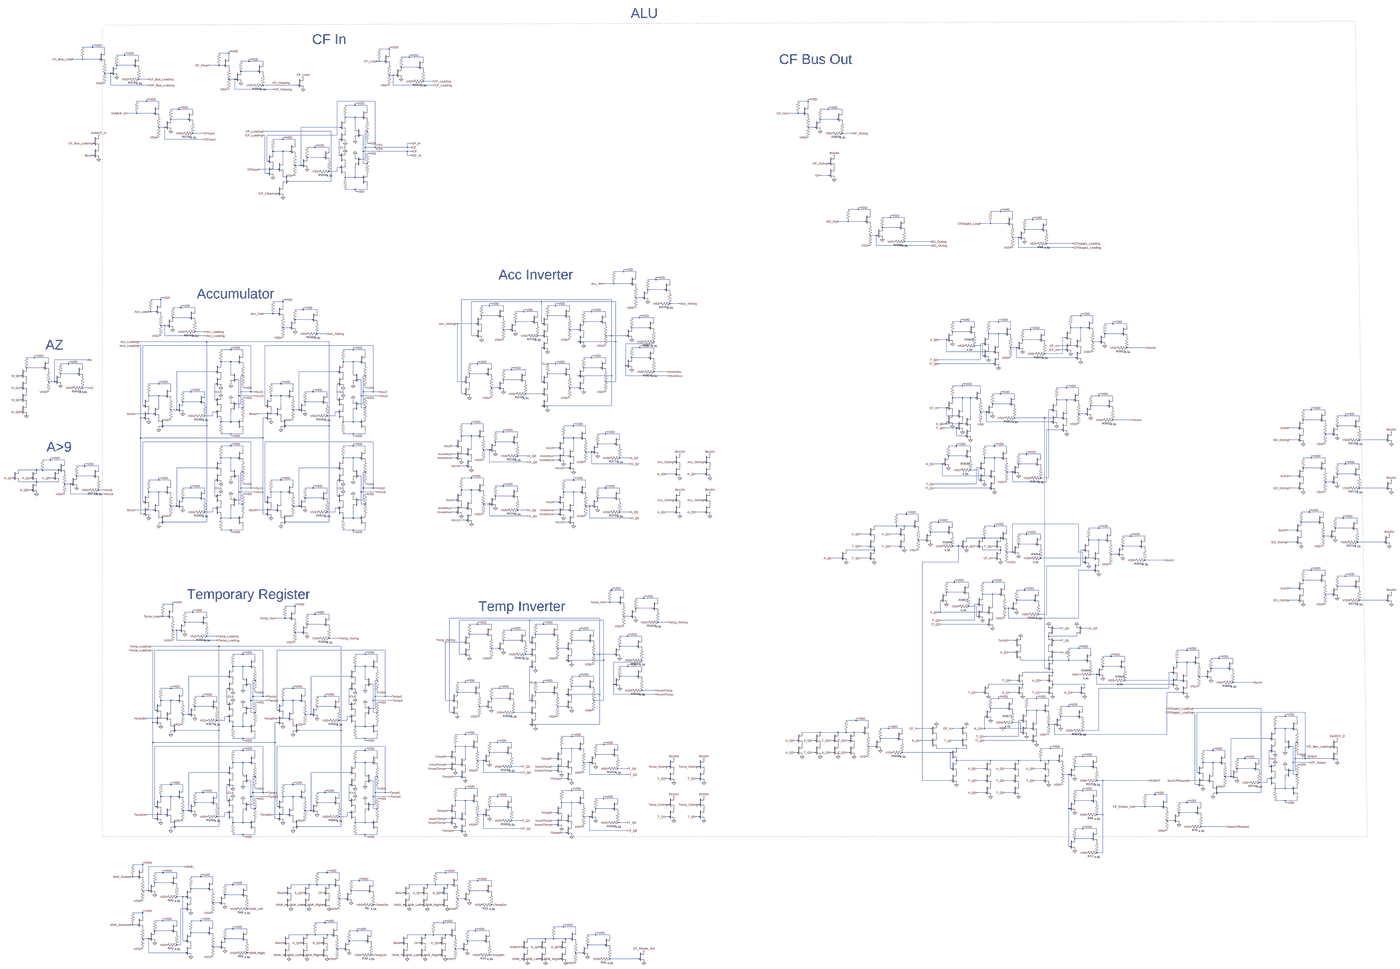
[diagram p0: schematic alu.asc, whole sheet]
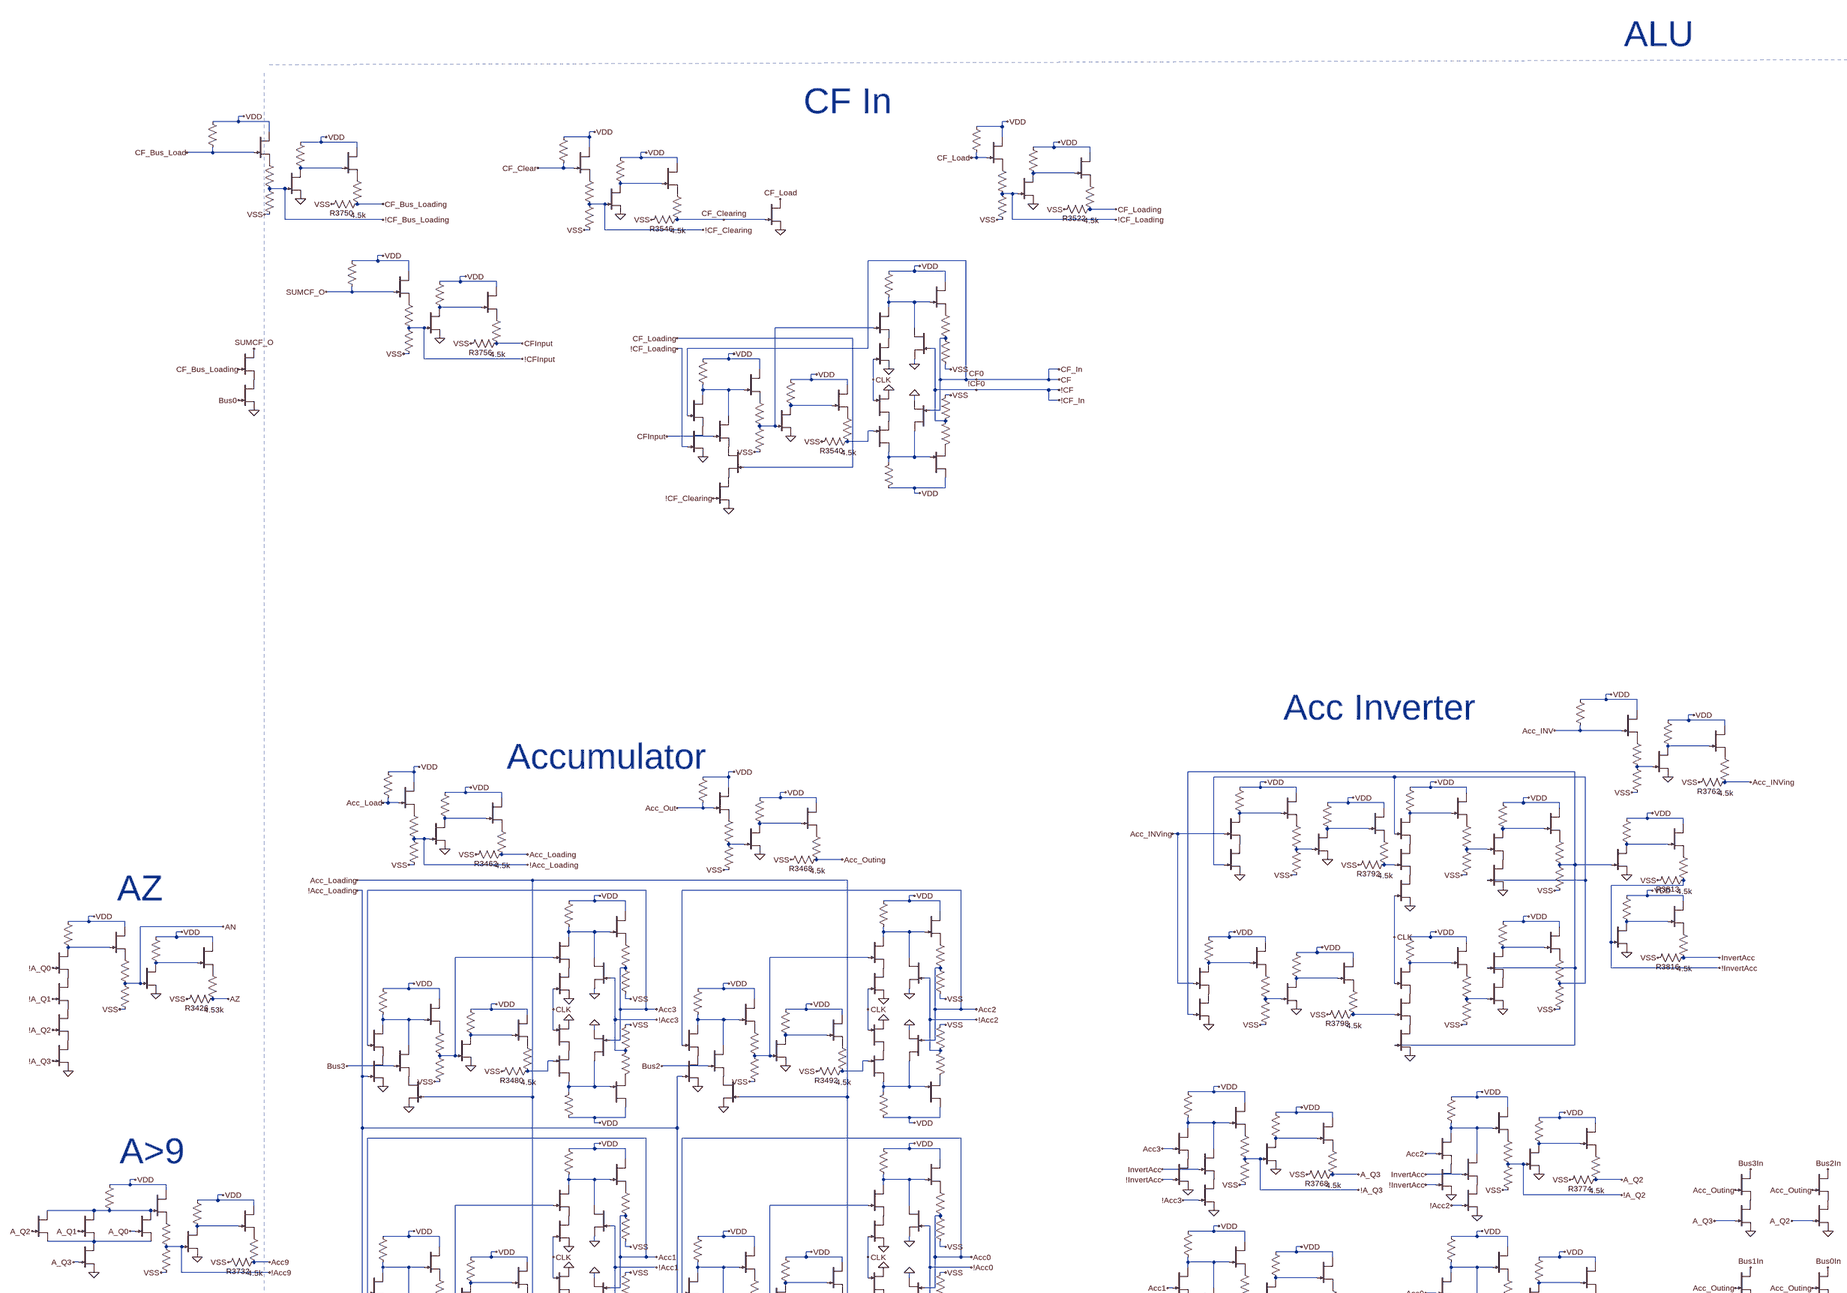
[diagram p1: schematic alu.asc, part, row 1 of 2, column 1 of 2]
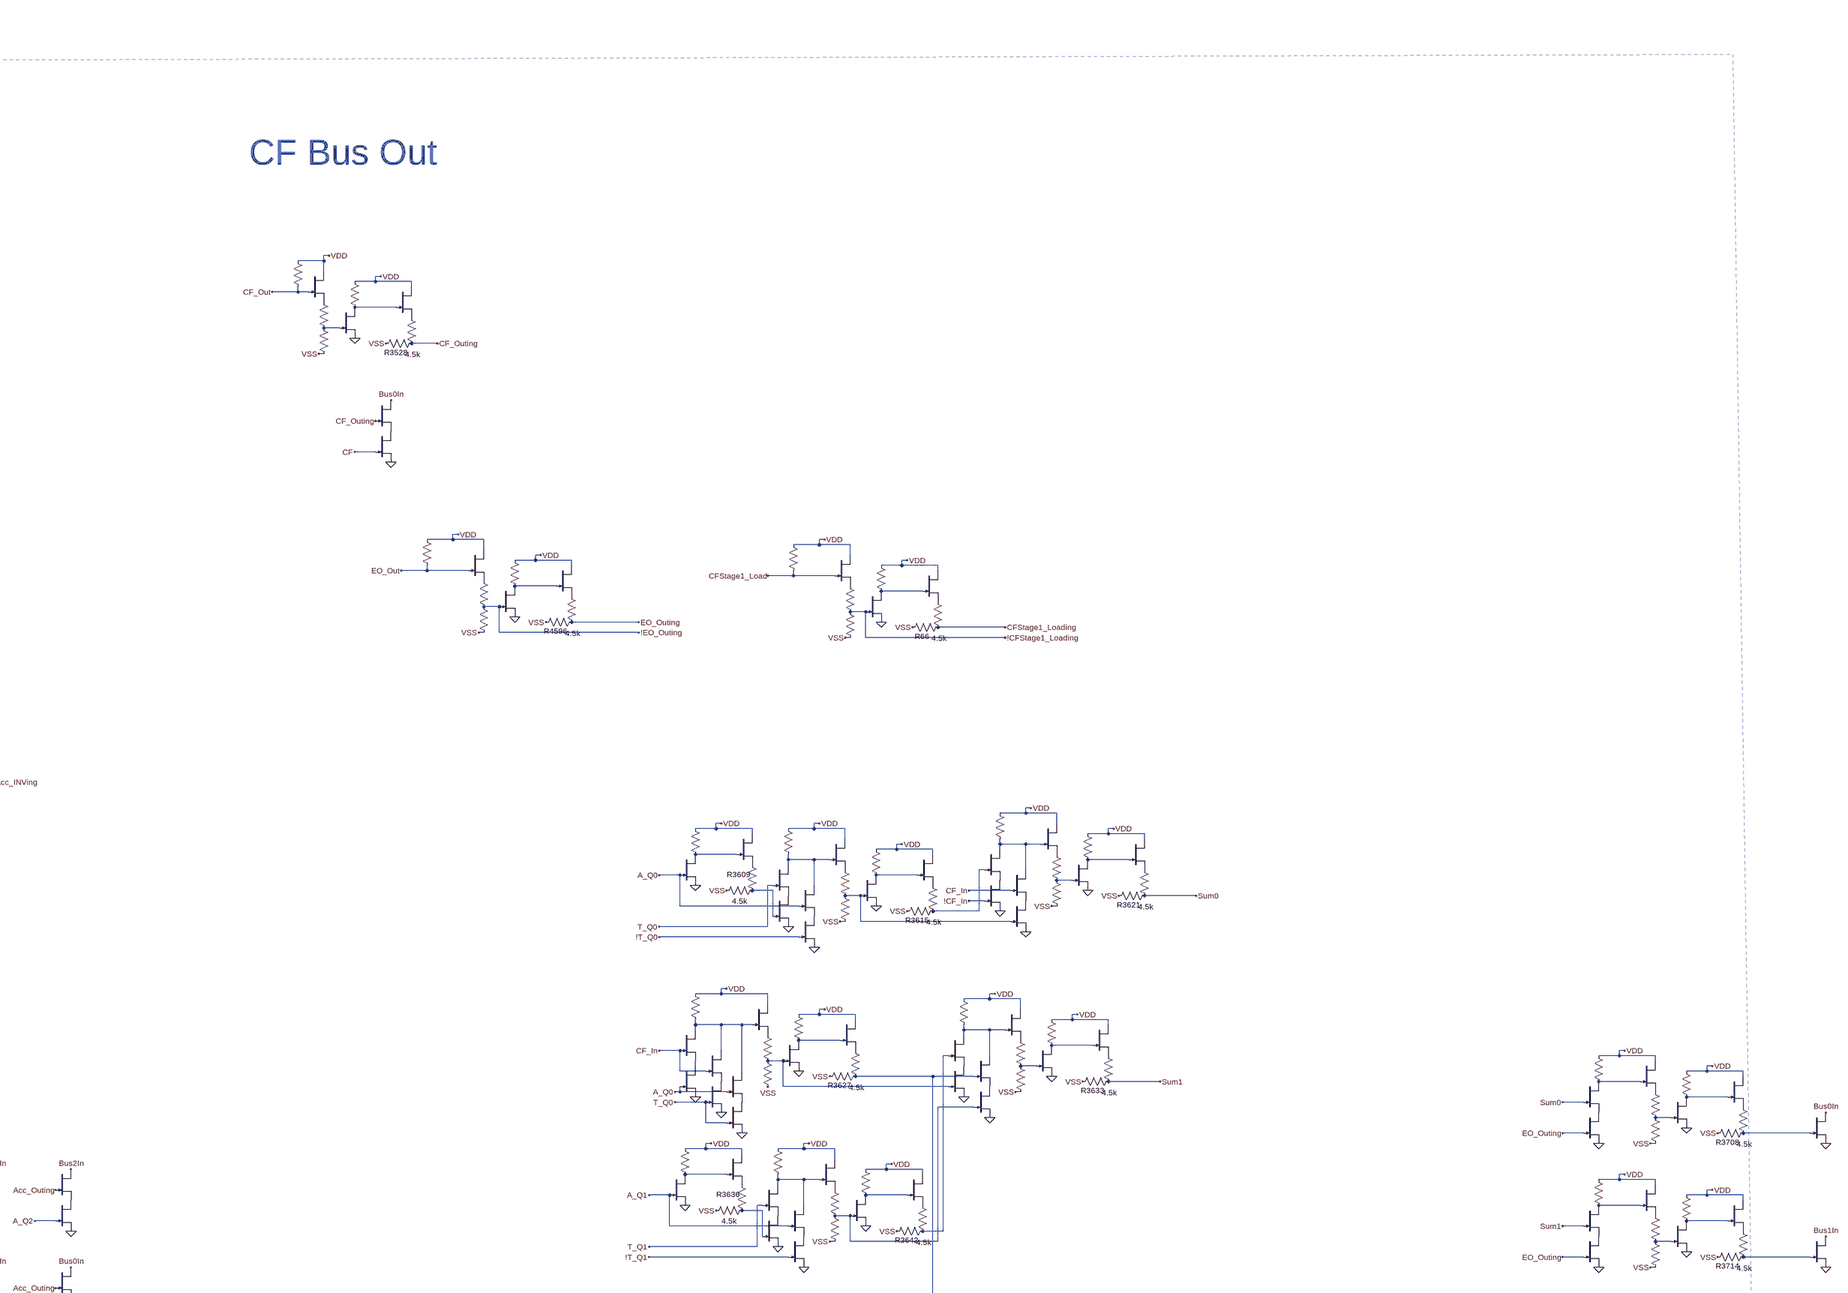
[diagram p2: schematic alu.asc, part, row 1 of 2, column 2 of 2]
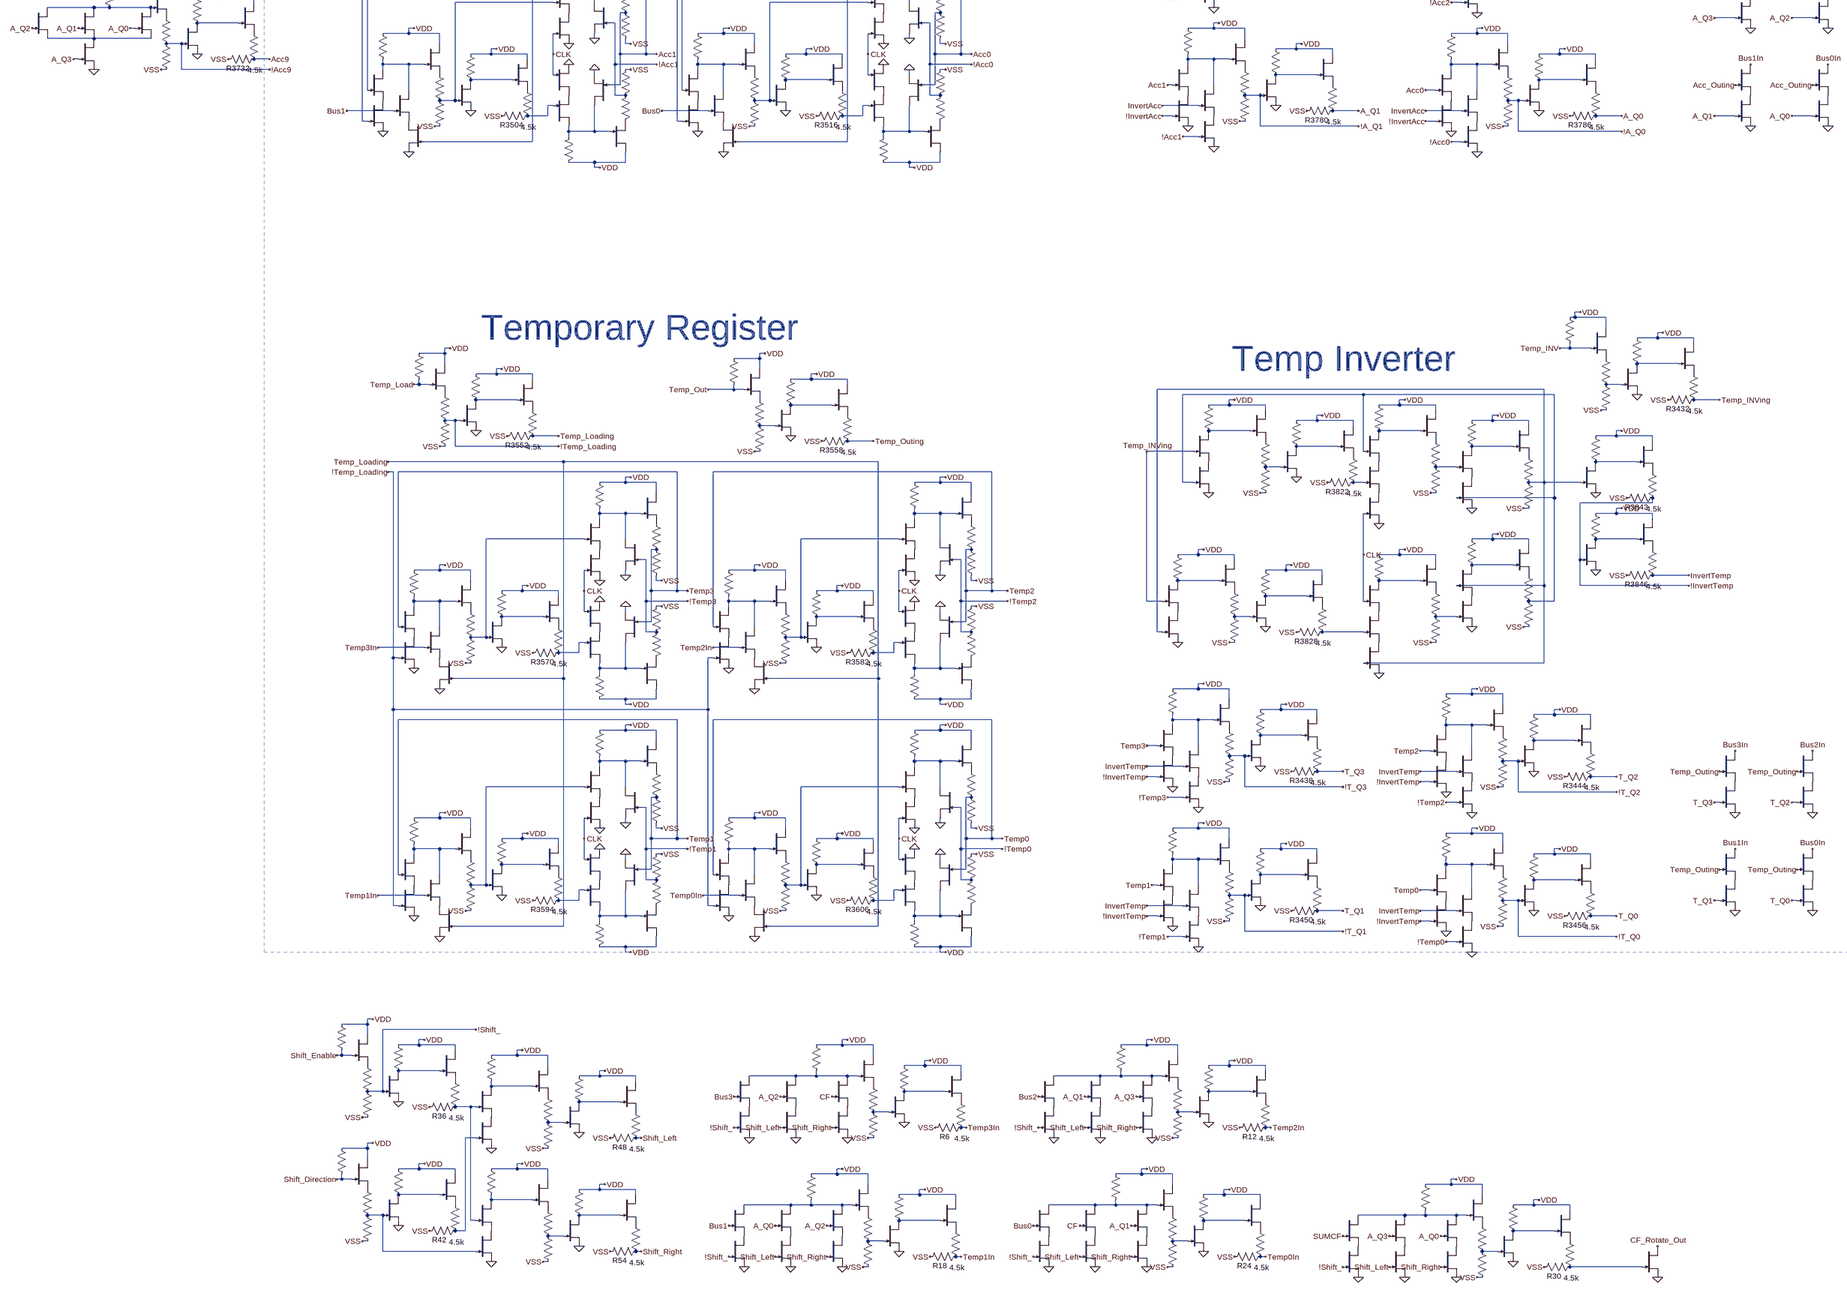
[diagram p3: schematic alu.asc, part, row 2 of 2, column 1 of 2]
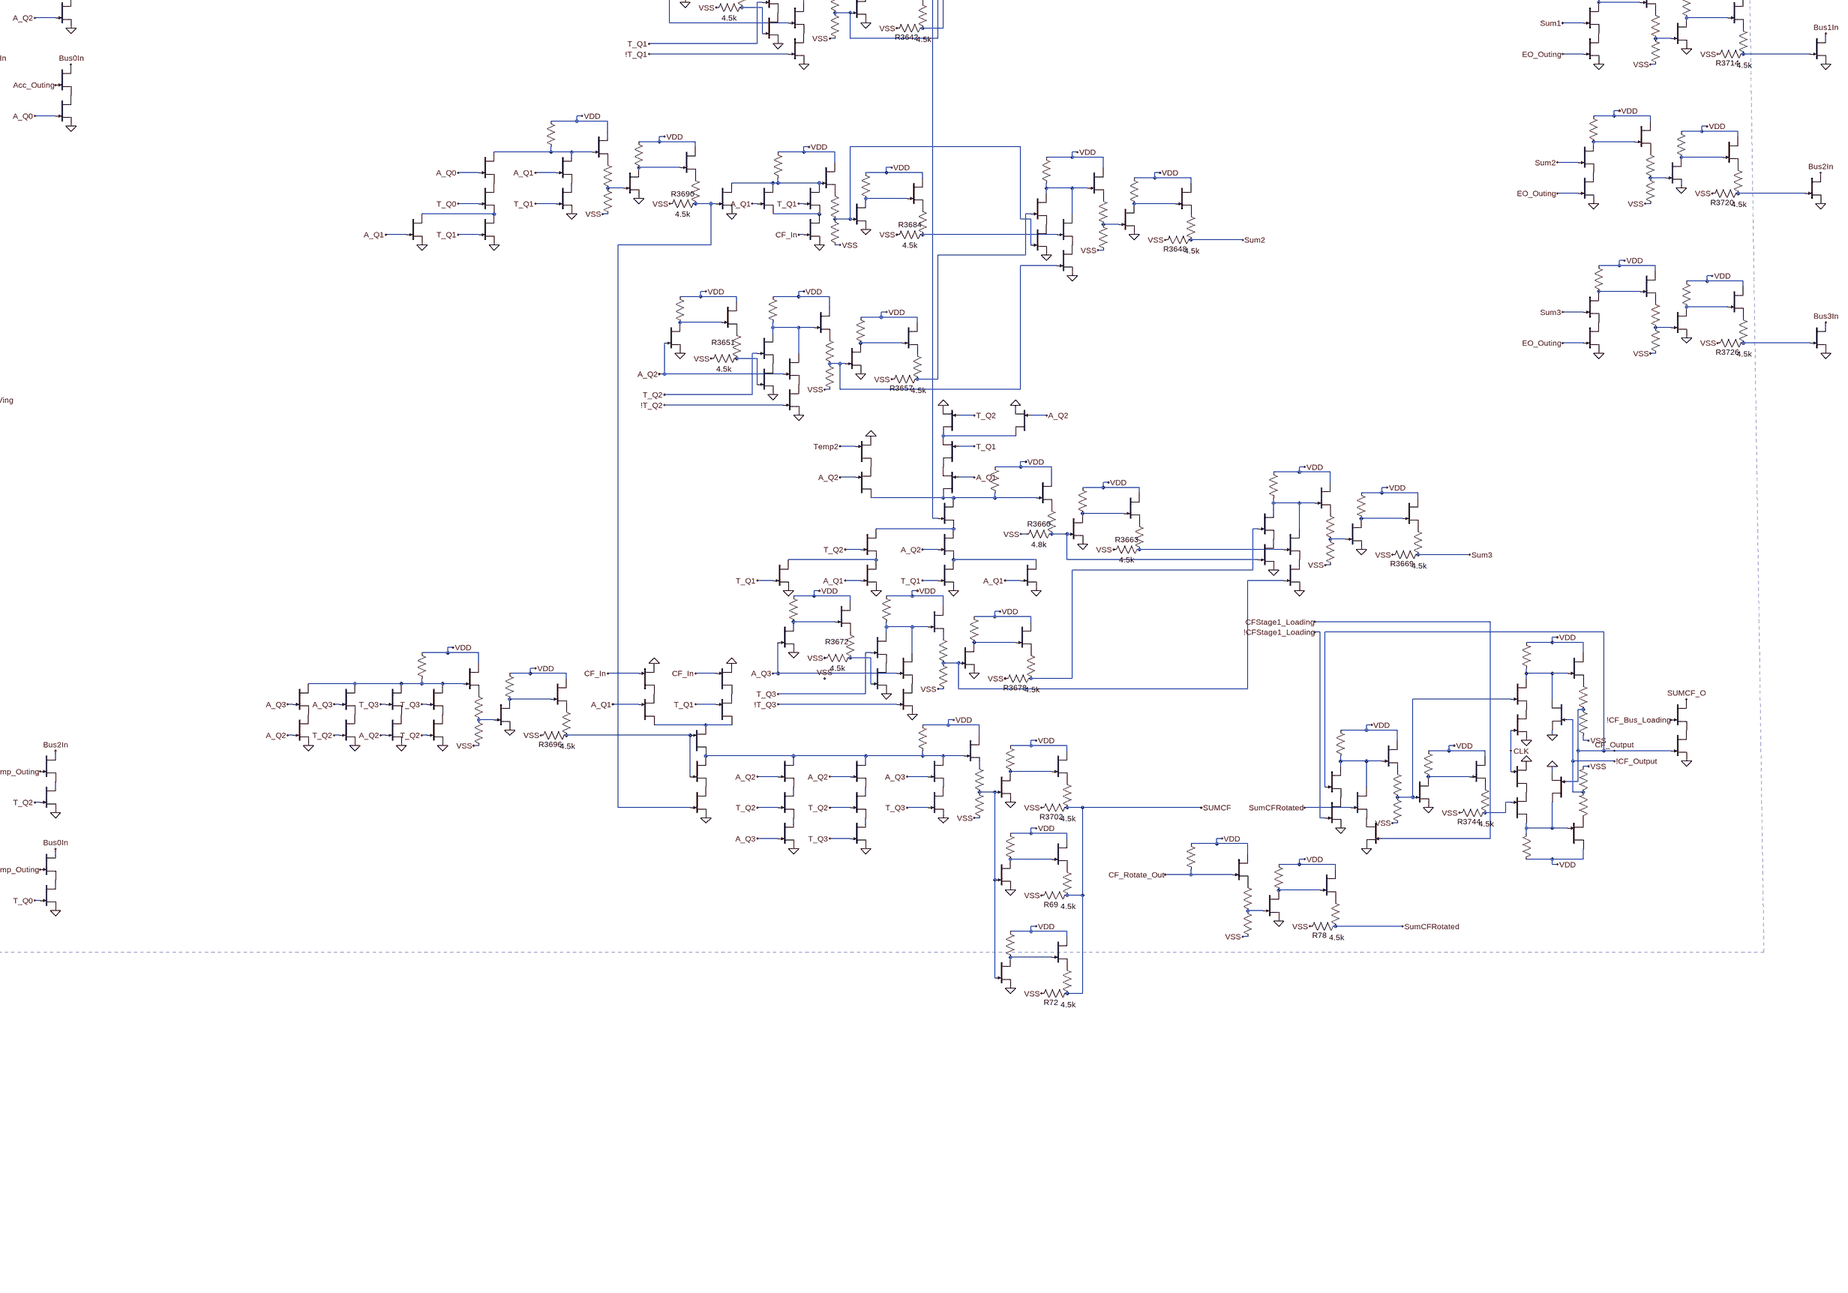
[diagram p4: schematic alu.asc, part, row 2 of 2, column 2 of 2]
* alu.asc
J_A2103 N042 !A_Q0 P001 DR
R3421 VDD N042 100k
J_F874 VDD N042 P002 DR
R3422 P002 AN 1k
R3423 AN VSS 4.8k
J_B993 P001 !A_Q1 P003 DR
J_A2104 N046 AN 0 DR
R3424 VDD N046 50k
J_F875 VDD N046 P004 DR
R3425 P004 AZ 1k
R3426 AZ VSS 4.53k
J_C1 P003 !A_Q2 P005 DR
J_D1 P005 !A_Q3 0 DR
J_A2105 P006 T_Q3 0 DR
J_A2106 Bus3In Temp_Outing P006 DR
J_A2107 P007 T_Q2 0 DR
J_A2108 Bus2In Temp_Outing P007 DR
J_A2109 P008 T_Q1 0 DR
J_A2110 Bus1In Temp_Outing P008 DR
J_A2111 P009 T_Q0 0 DR
J_A2112 Bus0In Temp_Outing P009 DR
R3427 VDD Temp_INV 100k
J_F876 VDD Temp_INV P010 DR
R3428 P010 N134 1k
R3429 N134 VSS 4.8k
J_A2113 N133 N134 0 DR
R3430 VDD N133 50k
J_A2114 VDD N133 P011 DR
R3431 P011 Temp_INVing 1k
R3432 Temp_INVing VSS 4.5k
J_A2115 N189 Temp3 P012 DR
R3433 VDD N189 100k
J_F877 VDD N189 P013 DR
R3434 P013 !T_Q3 1k
R3435 !T_Q3 VSS 4.8k
J_B994 N189 InvertTemp P014 DR
J_A2116 N193 !T_Q3 0 DR
R3436 VDD N193 50k
J_A2117 VDD N193 P015 DR
R3437 P015 T_Q3 1k
R3438 T_Q3 VSS 4.5k
J_A2118 P012 !InvertTemp 0 DR
J_B995 P014 !Temp3 0 DR
J_A2119 N191 Temp2 P016 DR
R3439 VDD N191 100k
J_F878 VDD N191 P017 DR
R3440 P017 !T_Q2 1k
R3441 !T_Q2 VSS 4.8k
J_B996 N191 InvertTemp P018 DR
J_A2120 N195 !T_Q2 0 DR
R3442 VDD N195 50k
J_A2121 VDD N195 P019 DR
R3443 P019 T_Q2 1k
R3444 T_Q2 VSS 4.5k
J_A2122 P016 !InvertTemp 0 DR
J_B997 P018 !Temp2 0 DR
J_A2123 N209 Temp1 P020 DR
R3445 VDD N209 100k
J_F879 VDD N209 P021 DR
R3446 P021 !T_Q1 1k
R3447 !T_Q1 VSS 4.8k
J_B998 N209 InvertTemp P022 DR
J_A2124 N214 !T_Q1 0 DR
R3448 VDD N214 50k
J_A2125 VDD N214 P023 DR
R3449 P023 T_Q1 1k
R3450 T_Q1 VSS 4.5k
J_A2126 P020 !InvertTemp 0 DR
J_B999 P022 !Temp1 0 DR
J_A2127 N213 Temp0 P024 DR
R3451 VDD N213 100k
J_F880 VDD N213 P025 DR
R3452 P025 !T_Q0 1k
R3453 !T_Q0 VSS 4.8k
J_B1000 N213 InvertTemp P026 DR
J_A2128 N215 !T_Q0 0 DR
R3454 VDD N215 50k
J_A2129 VDD N215 P027 DR
R3455 P027 T_Q0 1k
R3456 T_Q0 VSS 4.5k
J_A2130 P024 !InvertTemp 0 DR
J_B1001 P026 !Temp0 0 DR
R3457 VDD Acc_Load 100k
J_F881 VDD Acc_Load P028 DR
R3458 P028 !Acc_Loading 1k
R3459 !Acc_Loading VSS 4.8k
J_A2131 N021 !Acc_Loading 0 DR
R3460 VDD N021 50k
J_A2132 VDD N021 P029 DR
R3461 P029 Acc_Loading 1k
R3462 Acc_Loading VSS 4.5k
R3463 VDD Acc_Out 100k
J_F882 VDD Acc_Out P030 DR
R3464 P030 N025 1k
R3465 N025 VSS 4.8k
J_A2133 N022 N025 0 DR
R3466 VDD N022 50k
J_A2134 VDD N022 P031 DR
R3467 P031 Acc_Outing 1k
R3468 Acc_Outing VSS 4.5k
J_A2135 N040 N044 P032 DR
R3469 VDD N040 100k
J_F883 VDD N040 P033 DR
R3470 P033 Acc3 1k
R3471 Acc3 VSS 4.8k
J_B1002 N040 !Acc3 0 DR
J_A2136 N069 N062 P034 DR
R3472 VDD N069 100k
J_F884 VDD N069 P035 DR
R3473 P035 !Acc3 1k
R3474 !Acc3 VSS 4.8k
J_B1003 N069 Acc3 0 DR
J_A2137 P032 CLK 0 DR
J_A2138 P034 CLK 0 DR
J_A2139 N053 Acc3 P036 DR
R3475 VDD N053 100k
J_F885 VDD N053 P037 DR
R3476 P037 N044 1k
R3477 N044 VSS 4.8k
J_B1004 N053 Bus3 P038 DR
J_A2140 N057 N044 0 DR
R3478 VDD N057 50k
J_A2141 VDD N057 P039 DR
R3479 P039 N062 1k
R3480 N062 VSS 4.5k
J_A2142 P036 !Acc_Loading 0 DR
J_B1005 P038 Acc_Loading 0 DR
J_A2143 N041 N045 P040 DR
R3481 VDD N041 100k
J_F886 VDD N041 P041 DR
R3482 P041 Acc2 1k
R3483 Acc2 VSS 4.8k
J_B1006 N041 !Acc2 0 DR
J_A2144 N070 N063 P042 DR
R3484 VDD N070 100k
J_F887 VDD N070 P043 DR
R3485 P043 !Acc2 1k
R3486 !Acc2 VSS 4.8k
J_B1007 N070 Acc2 0 DR
J_A2145 P040 CLK 0 DR
J_A2146 P042 CLK 0 DR
J_A2147 N054 Acc2 P044 DR
R3487 VDD N054 100k
J_F888 VDD N054 P045 DR
R3488 P045 N045 1k
R3489 N045 VSS 4.8k
J_B1008 N054 Bus2 P046 DR
J_A2148 N058 N045 0 DR
R3490 VDD N058 50k
J_A2149 VDD N058 P047 DR
R3491 P047 N063 1k
R3492 N063 VSS 4.5k
J_A2150 P044 !Acc_Loading 0 DR
J_B1009 P046 Acc_Loading 0 DR
J_A2151 N080 N084 P048 DR
R3493 VDD N080 100k
J_F889 VDD N080 P049 DR
R3494 P049 Acc1 1k
R3495 Acc1 VSS 4.8k
J_B1010 N080 !Acc1 0 DR
J_A2152 N104 N102 P050 DR
R3496 VDD N104 100k
J_F890 VDD N104 P051 DR
R3497 P051 !Acc1 1k
R3498 !Acc1 VSS 4.8k
J_B1011 N104 Acc1 0 DR
J_A2153 P048 CLK 0 DR
J_A2154 P050 CLK 0 DR
J_A2155 N095 Acc1 P052 DR
R3499 VDD N095 100k
J_F891 VDD N095 P053 DR
R3500 P053 N084 1k
R3501 N084 VSS 4.8k
J_B1012 N095 Bus1 P054 DR
J_A2156 N099 N084 0 DR
R3502 VDD N099 50k
J_A2157 VDD N099 P055 DR
R3503 P055 N102 1k
R3504 N102 VSS 4.5k
J_A2158 P052 !Acc_Loading 0 DR
J_B1013 P054 Acc_Loading 0 DR
J_A2159 N081 N085 P056 DR
R3505 VDD N081 100k
J_F892 VDD N081 P057 DR
R3506 P057 Acc0 1k
R3507 Acc0 VSS 4.8k
J_B1014 N081 !Acc0 0 DR
J_A2160 N105 N103 P058 DR
R3508 VDD N105 100k
J_F893 VDD N105 P059 DR
R3509 P059 !Acc0 1k
R3510 !Acc0 VSS 4.8k
J_B1015 N105 Acc0 0 DR
J_A2161 P056 CLK 0 DR
J_A2162 P058 CLK 0 DR
J_A2163 N096 Acc0 P060 DR
R3511 VDD N096 100k
J_F894 VDD N096 P061 DR
R3512 P061 N085 1k
R3513 N085 VSS 4.8k
J_B1016 N096 Bus0 P062 DR
J_A2164 N100 N085 0 DR
R3514 VDD N100 50k
J_A2165 VDD N100 P063 DR
R3515 P063 N103 1k
R3516 N103 VSS 4.5k
J_A2166 P060 !Acc_Loading 0 DR
J_B1017 P062 Acc_Loading 0 DR
R3517 VDD CF_Load 100k
J_F895 VDD CF_Load P064 DR
R3518 P064 !CF_Loading 1k
R3519 !CF_Loading VSS 4.8k
J_A2167 N002 !CF_Loading 0 DR
R3520 VDD N002 50k
J_A2168 VDD N002 P065 DR
R3521 P065 CF_Loading 1k
R3522 CF_Loading VSS 4.5k
R3523 VDD CF_Out 100k
J_F896 VDD CF_Out P066 DR
R3524 P066 N008 1k
R3525 N008 VSS 4.8k
J_A2169 N006 N008 0 DR
R3526 VDD N006 50k
J_A2170 VDD N006 P067 DR
R3527 P067 CF_Outing 1k
R3528 CF_Outing VSS 4.5k
J_A2171 N004 N007 P068 DR
R3529 VDD N004 100k
J_F897 VDD N004 P069 DR
R3530 P069 CF0 1k
R3531 CF0 VSS 4.8k
J_B1018 N004 !CF 0 DR
J_A2172 N012 N011 P070 DR
R3532 VDD N012 100k
J_F898 VDD N012 P071 DR
R3533 P071 !CF 1k
R3534 !CF VSS 4.8k
J_B1019 N012 CF0 0 DR
J_A2173 P068 CLK 0 DR
J_A2174 P070 CLK 0 DR
J_A2175 N009 CF0 P072 DR
R3535 VDD N009 100k
J_F899 VDD N009 P073 DR
R3536 P073 N007 1k
R3537 N007 VSS 4.8k
J_B1020 N009 CFInput P074 DR
J_A2176 N010 N007 0 DR
R3538 VDD N010 50k
J_A2177 VDD N010 P075 DR
R3539 P075 N011 1k
R3540 N011 VSS 4.5k
J_A2178 P072 !CF_Loading 0 DR
J_B1021 P074 CF_Loading P076 DR
R3541 VDD CF_Clear 100k
J_F900 VDD CF_Clear P077 DR
R3542 P077 !CF_Clearing 1k
R3543 !CF_Clearing VSS 4.8k
J_A2179 N003 !CF_Clearing 0 DR
R3544 VDD N003 50k
J_A2180 VDD N003 P078 DR
R3545 P078 CF_Clearing 1k
R3546 CF_Clearing VSS 4.5k
J_A2181 P079 CF0 0 DR
J_A2182 Bus0In CF_Outing P079 DR
J_B1022 CF_Load CF_Clearing 0 DR
J_B1023 P076 !CF_Clearing 0 DR
R3547 VDD Temp_Load 100k
J_F901 VDD Temp_Load P080 DR
R3548 P080 !Temp_Loading 1k
R3549 !Temp_Loading VSS 4.8k
J_A2183 N137 !Temp_Loading 0 DR
R3550 VDD N137 50k
J_A2184 VDD N137 P081 DR
R3551 P081 Temp_Loading 1k
R3552 Temp_Loading VSS 4.5k
R3553 VDD Temp_Out 100k
J_F902 VDD Temp_Out P082 DR
R3554 P082 N139 1k
R3555 N139 VSS 4.8k
J_A2185 N138 N139 0 DR
R3556 VDD N138 50k
J_A2186 VDD N138 P083 DR
R3557 P083 Temp_Outing 1k
R3558 Temp_Outing VSS 4.5k
J_A2187 N151 N158 P084 DR
R3559 VDD N151 100k
J_F903 VDD N151 P085 DR
R3560 P085 Temp3 1k
R3561 Temp3 VSS 4.8k
J_B1024 N151 !Temp3 0 DR
J_A2188 N183 N179 P086 DR
R3562 VDD N183 100k
J_F904 VDD N183 P087 DR
R3563 P087 !Temp3 1k
R3564 !Temp3 VSS 4.8k
J_B1025 N183 Temp3 0 DR
J_A2189 P084 CLK 0 DR
J_A2190 P086 CLK 0 DR
J_A2191 N170 Temp3 P088 DR
R3565 VDD N170 100k
J_F905 VDD N170 P089 DR
R3566 P089 N158 1k
R3567 N158 VSS 4.8k
J_B1026 N170 Temp3In P090 DR
J_A2192 N172 N158 0 DR
R3568 VDD N172 50k
J_A2193 VDD N172 P091 DR
R3569 P091 N179 1k
R3570 N179 VSS 4.5k
J_A2194 P088 !Temp_Loading 0 DR
J_B1027 P090 Temp_Loading 0 DR
J_A2195 N152 N159 P092 DR
R3571 VDD N152 100k
J_F906 VDD N152 P093 DR
R3572 P093 Temp2 1k
R3573 Temp2 VSS 4.8k
J_B1028 N152 !Temp2 0 DR
J_A2196 N184 N180 P094 DR
R3574 VDD N184 100k
J_F907 VDD N184 P095 DR
R3575 P095 !Temp2 1k
R3576 !Temp2 VSS 4.8k
J_B1029 N184 Temp2 0 DR
J_A2197 P092 CLK 0 DR
J_A2198 P094 CLK 0 DR
J_A2199 N171 Temp2 P096 DR
R3577 VDD N171 100k
J_F908 VDD N171 P097 DR
R3578 P097 N159 1k
R3579 N159 VSS 4.8k
J_B1030 N171 Temp2In P098 DR
J_A2200 N173 N159 0 DR
R3580 VDD N173 50k
J_A2201 VDD N173 P099 DR
R3581 P099 N180 1k
R3582 N180 VSS 4.5k
J_A2202 P096 !Temp_Loading 0 DR
J_B1031 P098 Temp_Loading 0 DR
J_A2203 N197 N202 P100 DR
R3583 VDD N197 100k
J_F909 VDD N197 P101 DR
R3584 P101 Temp1 1k
R3585 Temp1 VSS 4.8k
J_B1032 N197 !Temp1 0 DR
J_A2204 N220 N216 P102 DR
R3586 VDD N220 100k
J_F910 VDD N220 P103 DR
R3587 P103 !Temp1 1k
R3588 !Temp1 VSS 4.8k
J_B1033 N220 Temp1 0 DR
J_A2205 P100 CLK 0 DR
J_A2206 P102 CLK 0 DR
J_A2207 N207 Temp1 P104 DR
R3589 VDD N207 100k
J_F911 VDD N207 P105 DR
R3590 P105 N202 1k
R3591 N202 VSS 4.8k
J_B1034 N207 Temp1In P106 DR
J_A2208 N211 N202 0 DR
R3592 VDD N211 50k
J_A2209 VDD N211 P107 DR
R3593 P107 N216 1k
R3594 N216 VSS 4.5k
J_A2210 P104 !Temp_Loading 0 DR
J_B1035 P106 Temp_Loading 0 DR
J_A2211 N198 N203 P108 DR
R3595 VDD N198 100k
J_F912 VDD N198 P109 DR
R3596 P109 Temp0 1k
R3597 Temp0 VSS 4.8k
J_B1036 N198 !Temp0 0 DR
J_A2212 N221 N217 P110 DR
R3598 VDD N221 100k
J_F913 VDD N221 P111 DR
R3599 P111 !Temp0 1k
R3600 !Temp0 VSS 4.8k
J_B1037 N221 Temp0 0 DR
J_A2213 P108 CLK 0 DR
J_A2214 P110 CLK 0 DR
J_A2215 N208 Temp0 P112 DR
R3601 VDD N208 100k
J_F914 VDD N208 P113 DR
R3602 P113 N203 1k
R3603 N203 VSS 4.8k
J_B1038 N208 Temp0In P114 DR
J_A2216 N212 N203 0 DR
R3604 VDD N212 50k
J_A2217 VDD N212 P115 DR
R3605 P115 N217 1k
R3606 N217 VSS 4.5k
J_A2218 P112 !Temp_Loading 0 DR
J_B1039 P114 Temp_Loading 0 DR
J_A2219 N112 A_Q1 N120 DR
J_A2220 N030 A_Q0 0 DR
R3607 VDD N030 50k
J_A2221 VDD N030 P116 DR
R3608 P116 N037 1k
R3609 N037 VSS 4.5k
J_A2222 N031 T_Q0 P117 DR
R3610 VDD N031 100k
J_F915 VDD N031 P118 DR
R3611 P118 N038 1k
R3612 N038 VSS 4.8k
J_B1040 N031 A_Q0 P119 DR
J_A2223 N035 N038 0 DR
R3613 VDD N035 50k
J_A2224 VDD N035 P120 DR
R3614 P120 N034 1k
R3615 N034 VSS 4.5k
J_A2225 P117 N037 0 DR
J_B1041 P119 !T_Q0 0 DR
J_A2226 N027 N034 P121 DR
R3616 VDD N027 100k
J_F916 VDD N027 P122 DR
R3617 P122 N036 1k
R3618 N036 VSS 4.8k
J_B1042 N027 CF0 P123 DR
J_A2227 N032 N036 0 DR
R3619 VDD N032 50k
J_A2228 VDD N032 P124 DR
R3620 P124 Sum0 1k
R3621 Sum0 VSS 4.5k
J_A2229 P121 !CF 0 DR
J_B1043 P123 N038 0 DR
J_A2230 N055 CF0 N065 DR
R3622 VDD N055 100k
J_F917 VDD N055 P125 DR
R3623 P125 N064 1k
R3624 N064 VSS 4.8k
J_B1044 N055 CF0 P126 DR
J_A2231 N059 N064 0 DR
R3625 VDD N059 50k
J_A2232 VDD N059 P127 DR
R3626 P127 N067 1k
R3627 N067 VSS 4.5k
J_A2233 N065 A_Q0 0 DR
J_B1045 P126 T_Q0 0 DR
J_B1046 N055 A_Q0 P128 DR
J_B1047 P128 T_Q0 0 DR
J_A2234 N056 N061 P129 DR
R3628 VDD N056 100k
J_F918 VDD N056 P130 DR
R3629 P130 N066 1k
R3630 N066 VSS 4.8k
J_B1048 N056 N067 P131 DR
J_A2235 N060 N066 0 DR
R3631 VDD N060 50k
J_A2236 VDD N060 P132 DR
R3632 P132 Sum1 1k
R3633 Sum1 VSS 4.5k
J_A2237 P129 N064 0 DR
J_B1049 P131 N072 0 DR
J_A2238 N079 A_Q1 0 DR
R3634 VDD N079 50k
J_A2239 VDD N079 P133 DR
R3635 P133 N088 1k
R3636 N088 VSS 4.5k
J_A2240 N082 T_Q1 P134 DR
R3637 VDD N082 100k
J_F919 VDD N082 P135 DR
R3638 P135 N072 1k
R3639 N072 VSS 4.8k
J_B1050 N082 A_Q1 P136 DR
J_A2241 N083 N072 0 DR
R3640 VDD N083 50k
J_A2242 VDD N083 P137 DR
R3641 P137 N061 1k
R3642 N061 VSS 4.5k
J_A2243 P134 N088 0 DR
J_B1051 P136 !T_Q1 0 DR
J_A2244 N112 T_Q1 N120 DR
J_A2245 N114 N121 P138 DR
R3643 VDD N114 100k
J_F920 VDD N114 P139 DR
R3644 P139 N122 1k
R3645 N122 VSS 4.8k
J_B1052 N114 N123 P140 DR
J_A2246 N118 N122 0 DR
R3646 VDD N118 50k
J_A2247 VDD N118 P141 DR
R3647 P141 Sum2 1k
R3648 Sum2 VSS 4.5k
J_A2248 P138 N107 0 DR
J_B1053 P140 N124 0 DR
J_A2249 N127 A_Q2 0 DR
R3649 VDD N127 50k
J_A2250 VDD N127 P142 DR
R3650 P142 N132 1k
R3651 N132 VSS 4.5k
J_A2251 N128 T_Q2 P143 DR
R3652 VDD N128 100k
J_F921 VDD N128 P144 DR
R3653 P144 N124 1k
R3654 N124 VSS 4.8k
J_B1054 N128 A_Q2 P145 DR
J_A2252 N130 N124 0 DR
R3655 VDD N130 50k
J_A2253 VDD N130 P146 DR
R3656 P146 N121 1k
R3657 N121 VSS 4.5k
J_A2254 P143 N132 0 DR
J_B1055 P145 !T_Q2 0 DR
R3658 VDD N149 100k
J_F922 VDD N149 P147 DR
R3659 P147 N157 1k
R3660 N157 VSS 4.8k
J_A2255 N153 N157 0 DR
R3661 VDD N153 50k
J_A2256 VDD N153 P148 DR
R3662 P148 N162 1k
R3663 N162 VSS 4.5k
J_A2257 N149 A_Q2 P149 DR
J_B1056 P149 Temp2 0 DR
J_A2258 N149 A_Q1 P150 DR
J_B1057 P150 T_Q1 N142 DR
J_B1058 N142 T_Q2 0 DR
J_B1059 N142 A_Q2 0 DR
J_A2259 N164 A_Q1 0 DR
J_A2260 N155 T_Q2 N163 DR
J_B1060 N163 A_Q1 0 DR
J_A2261 N164 T_Q1 0 DR
J_B1061 N155 A_Q2 N164 DR
J_B1062 N163 T_Q1 0 DR
J_B1063 N149 N067 N155 DR
J_A2262 N150 N156 P151 DR
R3664 VDD N150 100k
J_F923 VDD N150 P152 DR
R3665 P152 N161 1k
R3666 N161 VSS 4.8k
J_B1064 N150 N162 P153 DR
J_A2263 N154 N161 0 DR
R3667 VDD N154 50k
J_A2264 VDD N154 P154 DR
R3668 P154 Sum3 1k
R3669 Sum3 VSS 4.5k
J_A2265 P151 N157 0 DR
J_B1065 P153 N168 0 DR
J_A2266 N176 A_Q3 0 DR
R3670 VDD N176 50k
J_A2267 VDD N176 P155 DR
R3671 P155 N182 1k
R3672 N182 VSS 4.5k
J_A2268 N177 T_Q3 P156 DR
R3673 VDD N177 100k
J_F924 VDD N177 P157 DR
R3674 P157 N168 1k
R3675 N168 VSS 4.8k
J_B1066 N177 A_Q3 P158 DR
J_A2269 N181 N168 0 DR
R3676 VDD N181 50k
J_A2270 VDD N181 P159 DR
R3677 P159 N156 1k
R3678 N156 VSS 4.5k
J_A2271 P156 N182 0 DR
J_B1067 P158 !T_Q3 0 DR
R3679 VDD N112 100k
J_F925 VDD N112 P160 DR
R3680 P160 N107 1k
R3681 N107 VSS 4.8k
J_A2272 N116 N107 0 DR
R3682 VDD N116 50k
J_A2273 VDD N116 P161 DR
R3683 P161 N123 1k
R3684 N123 VSS 4.5k
J_A2274 N108 A_Q1 P162 DR
J_B1068 P162 T_Q1 0 DR
J_A2275 N108 A_Q0 P163 DR
J_B1069 P163 T_Q0 N119 DR
R3685 VDD N108 100k
J_F926 VDD N108 P164 DR
R3686 P164 N113 1k
R3687 N113 VSS 4.8k
J_A2276 N110 N113 0 DR
R3688 VDD N110 50k
J_A2277 VDD N110 P165 DR
R3689 P165 N117 1k
R3690 N117 VSS 4.5k
J_B1070 N119 A_Q1 0 DR
J_B1071 N119 T_Q1 0 DR
J_B1072 N120 CF0 0 DR
J_A2278 N112 N117 0 DR
J_A2279 N196 N194 P166 DR
J_B1073 P166 N117 0 DR
J_A2280 N192 T_Q1 P167 DR
J_B1074 P167 CF0 0 DR
J_A2281 N192 A_Q1 P168 DR
J_B1075 P168 CF0 0 DR
R3691 VDD N186 100k
J_F927 VDD N186 P169 DR
R3692 P169 N190 1k
R3693 N190 VSS 4.8k
J_A2282 N187 N190 0 DR
R3694 VDD N187 50k
J_A2283 VDD N187 P170 DR
R3695 P170 N194 1k
R3696 N194 VSS 4.5k
J_A2284 N186 A_Q3 P171 DR
J_A2285 N186 T_Q3 P172 DR
J_B1076 P171 T_Q2 0 DR
J_B1077 P172 T_Q2 0 DR
J_A2286 N196 A_Q3 P173 DR
J_B1078 P173 T_Q3 0 DR
J_A2287 N196 A_Q2 P174 DR
J_B1079 P174 T_Q2 P175 DR
J_B1080 P175 T_Q3 0 DR
J_A2288 N196 A_Q2 P176 DR
J_B1081 P176 T_Q2 P177 DR
J_B1082 P177 A_Q3 0 DR
J_A2289 N196 N194 N192 DR
R3697 VDD N196 100k
J_F928 VDD N196 P178 DR
R3698 P178 N204 1k
R3699 N204 VSS 4.8k
J_A2290 N200 N204 0 DR
R3700 VDD N200 50k
J_A2291 VDD N200 P179 DR
R3701 P179 SUMCF 1k
R3702 SUMCF VSS 4.5k
J_A2292 N068 Sum0 P180 DR
R3703 VDD N068 100k
J_F929 VDD N068 P181 DR
R3704 P181 N073 1k
R3705 N073 VSS 4.8k
J_B1083 P180 EO_Outing 0 DR
J_A2293 N071 N073 0 DR
R3706 VDD N071 50k
J_F930 VDD N071 P182 DR
R3707 P182 N076 1k
R3708 N076 VSS 4.5k
J_A2294 Bus0In N076 0 DR
J_A2295 N086 Sum1 P183 DR
R3709 VDD N086 100k
J_F931 VDD N086 P184 DR
R3710 P184 N092 1k
R3711 N092 VSS 4.8k
J_B1084 P183 EO_Outing 0 DR
J_A2296 N089 N092 0 DR
R3712 VDD N089 50k
J_F932 VDD N089 P185 DR
R3713 P185 N093 1k
R3714 N093 VSS 4.5k
J_A2297 Bus1In N093 0 DR
J_A2298 N106 Sum2 P186 DR
R3715 VDD N106 100k
J_F933 VDD N106 P187 DR
R3716 P187 N111 1k
R3717 N111 VSS 4.8k
J_B1085 P186 EO_Outing 0 DR
J_A2299 N109 N111 0 DR
R3718 VDD N109 50k
J_F934 VDD N109 P188 DR
R3719 P188 N115 1k
R3720 N115 VSS 4.5k
J_A2300 Bus2In N115 0 DR
J_A2301 N125 Sum3 P189 DR
R3721 VDD N125 100k
J_F935 VDD N125 P190 DR
R3722 P190 N129 1k
R3723 N129 VSS 4.8k
J_B1086 P189 EO_Outing 0 DR
J_A2302 N126 N129 0 DR
R3724 VDD N126 50k
J_F936 VDD N126 P191 DR
R3725 P191 N131 1k
R3726 N131 VSS 4.5k
J_A2303 Bus3In N131 0 DR
J_A2304 N087 A_Q0 N091 DR
R3727 VDD N087 100k
J_F937 VDD N087 P192 DR
R3728 P192 !Acc9 1k
R3729 !Acc9 VSS 4.8k
J_B1087 N087 A_Q1 N091 DR
J_A2305 N090 !Acc9 0 DR
R3730 VDD N090 50k
J_F938 VDD N090 P193 DR
R3731 P193 Acc9 1k
R3732 Acc9 VSS 4.5k
J_A2306 N091 A_Q3 0 DR
J_B1088 N087 A_Q2 N091 DR
J_A2307 N185 N188 P194 DR
R3733 VDD N185 100k
J_F939 VDD N185 P195 DR
R3734 P195 CF_Output 1k
R3735 CF_Output VSS 4.8k
J_B1089 N185 !CF_Output 0 DR
J_A2308 N206 N205 P196 DR
R3736 VDD N206 100k
J_F940 VDD N206 P197 DR
R3737 P197 !CF_Output 1k
R3738 !CF_Output VSS 4.8k
J_B1090 N206 CF_Output 0 DR
J_A2309 P194 CLK 0 DR
J_A2310 P196 CLK 0 DR
J_A2311 N199 CF_Output P198 DR
R3739 VDD N199 100k
J_F941 VDD N199 P199 DR
R3740 P199 N188 1k
R3741 N188 VSS 4.8k
J_B1091 N199 SumCFRotated P200 DR
J_A2312 N201 N188 0 DR
R3742 VDD N201 50k
J_A2313 VDD N201 P201 DR
R3743 P201 N205 1k
R3744 N205 VSS 4.5k
J_A2314 P198 !CFStage1_Loading 0 DR
J_B1092 P200 CFStage1_Loading 0 DR
R3745 VDD CF_Bus_Load 100k
J_F942 VDD CF_Bus_Load P202 DR
R3746 P202 !CF_Bus_Loading 1k
R3747 !CF_Bus_Loading VSS 4.8k
J_A2315 N001 !CF_Bus_Loading 0 DR
R3748 VDD N001 50k
J_A2316 VDD N001 P203 DR
R3749 P203 CF_Bus_Loading 1k
R3750 CF_Bus_Loading VSS 4.5k
J_A2317 P204 CF_Output 0 DR
J_A2318 SUMCF_O !CF_Bus_Loading P204 DR
J_A2319 SUMCF_O CF_Bus_Loading P205 DR
J_A2320 P205 Bus0 0 DR
R3751 VDD SUMCF_O 100k
J_F943 VDD SUMCF_O P206 DR
R3752 P206 !CFInput 1k
R3753 !CFInput VSS 4.8k
J_A2321 N005 !CFInput 0 DR
R3754 VDD N005 50k
J_A2322 VDD N005 P207 DR
R3755 P207 CFInput 1k
R3756 CFInput VSS 4.5k
J_A2323 P208 A_Q3 0 DR
J_A2324 Bus3In Acc_Outing P208 DR
J_A2325 P209 A_Q2 0 DR
J_A2326 Bus2In Acc_Outing P209 DR
J_A2327 P210 A_Q1 0 DR
J_A2328 Bus1In Acc_Outing P210 DR
J_A2329 P211 A_Q0 0 DR
J_A2330 Bus0In Acc_Outing P211 DR
R3757 VDD Acc_INV 100k
J_F944 VDD Acc_INV P212 DR
R3758 P212 N016 1k
R3759 N016 VSS 4.8k
J_A2331 N015 N016 0 DR
R3760 VDD N015 50k
J_A2332 VDD N015 P213 DR
R3761 P213 Acc_INVing 1k
R3762 Acc_INVing VSS 4.5k
J_A2333 N074 Acc3 P214 DR
R3763 VDD N074 100k
J_F945 VDD N074 P215 DR
R3764 P215 !A_Q3 1k
R3765 !A_Q3 VSS 4.8k
J_B1093 N074 InvertAcc P216 DR
J_A2334 N077 !A_Q3 0 DR
R3766 VDD N077 50k
J_A2335 VDD N077 P217 DR
R3767 P217 A_Q3 1k
R3768 A_Q3 VSS 4.5k
J_A2336 P214 !InvertAcc 0 DR
J_B1094 P216 !Acc3 0 DR
J_A2337 N075 Acc2 P218 DR
R3769 VDD N075 100k
J_F946 VDD N075 P219 DR
R3770 P219 !A_Q2 1k
R3771 !A_Q2 VSS 4.8k
J_B1095 N075 InvertAcc P220 DR
J_A2338 N078 !A_Q2 0 DR
R3772 VDD N078 50k
J_A2339 VDD N078 P221 DR
R3773 P221 A_Q2 1k
R3774 A_Q2 VSS 4.5k
J_A2340 P218 !InvertAcc 0 DR
J_B1096 P220 !Acc2 0 DR
J_A2341 N094 Acc1 P222 DR
R3775 VDD N094 100k
J_F947 VDD N094 P223 DR
R3776 P223 !A_Q1 1k
R3777 !A_Q1 VSS 4.8k
J_B1097 N094 InvertAcc P224 DR
J_A2342 N098 !A_Q1 0 DR
R3778 VDD N098 50k
J_A2343 VDD N098 P225 DR
R3779 P225 A_Q1 1k
R3780 A_Q1 VSS 4.5k
J_A2344 P222 !InvertAcc 0 DR
J_B1098 P224 !Acc1 0 DR
J_A2345 N097 Acc0 P226 DR
R3781 VDD N097 100k
J_F948 VDD N097 P227 DR
R3782 P227 !A_Q0 1k
R3783 !A_Q0 VSS 4.8k
J_B1099 N097 InvertAcc P228 DR
J_A2346 N101 !A_Q0 0 DR
R3784 VDD N101 50k
J_A2347 VDD N101 P229 DR
R3785 P229 A_Q0 1k
R3786 A_Q0 VSS 4.5k
J_A2348 P226 !InvertAcc 0 DR
J_B1100 P228 !Acc0 0 DR
J_A2349 N019 Acc_INVing P230 DR
R3787 VDD N019 100k
J_F949 VDD N019 P231 DR
R3788 P231 N028 1k
R3789 N028 VSS 4.8k
J_B1101 P230 N018 0 DR
J_A2350 N023 N028 0 DR
R3790 VDD N023 50k
J_F950 VDD N023 P232 DR
R3791 P232 N033 1k
R3792 N033 VSS 4.5k
J_A2351 N047 Acc_INVing P233 DR
R3793 VDD N047 100k
J_F951 VDD N047 P234 DR
R3794 P234 N050 1k
R3795 N050 VSS 4.8k
J_B1102 P233 N017 0 DR
J_A2352 N049 N050 0 DR
R3796 VDD N049 50k
J_F952 VDD N049 P235 DR
R3797 P235 N052 1k
R3798 N052 VSS 4.5k
J_A2353 N020 N018 P236 DR
R3799 VDD N020 100k
J_F953 VDD N020 P237 DR
R3800 P237 N029 1k
R3801 N029 VSS 4.8k
J_B1103 P236 N033 P238 DR
J_A2354 N048 CLK P239 DR
R3802 VDD N048 100k
J_F954 VDD N048 P240 DR
R3803 P240 N051 1k
R3804 N051 VSS 4.8k
J_B1104 P239 N052 P241 DR
J_A2355 N024 N029 P242 DR
R3805 VDD N024 100k
J_F955 VDD N024 P243 DR
R3806 P243 N017 1k
R3807 N017 VSS 4.8k
J_B1105 P242 N018 0 DR
J_A2356 N043 N017 P244 DR
R3808 VDD N043 100k
J_F956 VDD N043 P245 DR
R3809 P245 N018 1k
R3810 N018 VSS 4.8k
J_B1106 P244 N051 0 DR
J_B1107 P238 CLK 0 DR
J_B1108 P241 N017 0 DR
J_A2357 N026 N017 0 DR
R3811 VDD N026 50k
J_F957 VDD N026 P246 DR
R3812 P246 !InvertAcc 1k
R3813 !InvertAcc VSS 4.5k
J_A2358 N039 !InvertAcc 0 DR
R3814 VDD N039 50k
J_F958 VDD N039 P247 DR
R3815 P247 InvertAcc 1k
R3816 InvertAcc VSS 4.5k
J_A2359 N140 Temp_INVing P248 DR
R3817 VDD N140 100k
J_F959 VDD N140 P249 DR
R3818 P249 N146 1k
R3819 N146 VSS 4.8k
J_B1109 P248 N136 0 DR
J_A2360 N143 N146 0 DR
R3820 VDD N143 50k
J_F960 VDD N143 P250 DR
R3821 P250 N148 1k
R3822 N148 VSS 4.5k
J_A2361 N166 Temp_INVing P251 DR
R3823 VDD N166 100k
J_F961 VDD N166 P252 DR
R3824 P252 N174 1k
R3825 N174 VSS 4.8k
J_B1110 P251 N135 0 DR
J_A2362 N169 N174 0 DR
R3826 VDD N169 50k
J_F962 VDD N169 P253 DR
R3827 P253 N178 1k
R3828 N178 VSS 4.5k
J_A2363 N141 N136 P254 DR
R3829 VDD N141 100k
J_F963 VDD N141 P255 DR
R3830 P255 N147 1k
R3831 N147 VSS 4.8k
J_B1111 P254 N148 P256 DR
J_A2364 N167 CLK P257 DR
R3832 VDD N167 100k
J_F964 VDD N167 P258 DR
R3833 P258 N175 1k
R3834 N175 VSS 4.8k
J_B1112 P257 N178 P259 DR
J_A2365 N144 N147 P260 DR
R3835 VDD N144 100k
J_F965 VDD N144 P261 DR
R3836 P261 N135 1k
R3837 N135 VSS 4.8k
J_B1113 P260 N136 0 DR
J_A2366 N165 N135 P262 DR
R3838 VDD N165 100k
J_F966 VDD N165 P263 DR
R3839 P263 N136 1k
R3840 N136 VSS 4.8k
J_B1114 P262 N175 0 DR
J_B1115 P256 CLK 0 DR
J_B1116 P259 N135 0 DR
J_A2367 N145 N135 0 DR
R3841 VDD N145 50k
J_F967 VDD N145 P264 DR
R3842 P264 !InvertTemp 1k
R3843 !InvertTemp VSS 4.5k
J_A2368 N160 !InvertTemp 0 DR
R3844 VDD N160 50k
J_F968 VDD N160 P265 DR
R3845 P265 InvertTemp 1k
R3846 InvertTemp VSS 4.5k
R4591 VDD EO_Out 100k
J_F1212 VDD EO_Out P266 DR
R4592 P266 !EO_Outing 1k
R4593 !EO_Outing VSS 4.8k
J_A2658 N013 !EO_Outing 0 DR
R4594 VDD N013 50k
J_A2659 VDD N013 P267 DR
R4595 P267 EO_Outing 1k
R4596 EO_Outing VSS 4.5k
J_A1 N224 A_Q2 P268 DR
R1 VDD N224 100k
J_F1 VDD N224 P269 DR
R2 P269 N231 1k
R3 N231 VSS 4.8k
J_B1 N224 CF0 P270 DR
J_A2 N227 N231 0 DR
R4 VDD N227 50k
J_A3 VDD N227 P271 DR
R5 P271 Temp3In 1k
R6 Temp3In VSS 4.5k
J_A4 P268 Shift_Left 0 DR
J_B2 P270 Shift_Right 0 DR
J_A5 N224 Bus3 P272 DR
J_A6 P272 !Shift_ 0 DR
J_A7 N225 A_Q1 P273 DR
R7 VDD N225 100k
J_F2 VDD N225 P274 DR
R8 P274 N232 1k
R9 N232 VSS 4.8k
J_B3 N225 A_Q3 P275 DR
J_A8 N228 N232 0 DR
R10 VDD N228 50k
J_A9 VDD N228 P276 DR
R11 P276 Temp2In 1k
R12 Temp2In VSS 4.5k
J_A10 P273 Shift_Left 0 DR
J_B4 P275 Shift_Right 0 DR
J_A11 N225 Bus2 P277 DR
J_A12 P277 !Shift_ 0 DR
J_A13 N237 A_Q0 P278 DR
R13 VDD N237 100k
J_F3 VDD N237 P279 DR
R14 P279 N246 1k
R15 N246 VSS 4.8k
J_B5 N237 A_Q2 P280 DR
J_A14 N242 N246 0 DR
R16 VDD N242 50k
J_A15 VDD N242 P281 DR
R17 P281 Temp1In 1k
R18 Temp1In VSS 4.5k
J_A16 P278 Shift_Left 0 DR
J_B6 P280 Shift_Right 0 DR
J_A17 N237 Bus1 P282 DR
J_A18 P282 !Shift_ 0 DR
J_A19 N238 CF0 P283 DR
R19 VDD N238 100k
J_F4 VDD N238 P284 DR
R20 P284 N247 1k
R21 N247 VSS 4.8k
J_B7 N238 A_Q1 P285 DR
J_A20 N243 N247 0 DR
R22 VDD N243 50k
J_A21 VDD N243 P286 DR
R23 P286 Temp0In 1k
R24 Temp0In VSS 4.5k
J_A22 P283 Shift_Left 0 DR
J_B8 P285 Shift_Right 0 DR
J_A23 N238 Bus0 P287 DR
J_A24 P287 !Shift_ 0 DR
J_A25 N241 A_Q3 P288 DR
R25 VDD N241 100k
J_F5 VDD N241 P289 DR
R26 P289 N248 1k
R27 N248 VSS 4.8k
J_B9 N241 A_Q0 P290 DR
J_A26 N244 N248 0 DR
R28 VDD N244 50k
J_A27 VDD N244 P291 DR
R29 P291 N249 1k
R30 N249 VSS 4.5k
J_A28 P288 Shift_Left 0 DR
J_B10 P290 Shift_Right 0 DR
J_A29 N241 SUMCF P292 DR
J_A30 P292 !Shift_ 0 DR
R31 VDD Shift_Enable 100k
J_F6 VDD Shift_Enable P293 DR
R32 P293 !Shift_ 1k
R33 !Shift_ VSS 4.8k
J_A31 N223 !Shift_ 0 DR
R34 VDD N223 50k
J_A32 VDD N223 P294 DR
R35 P294 N230 1k
R36 N230 VSS 4.5k
R37 VDD Shift_Direction 100k
J_F7 VDD Shift_Direction P295 DR
R38 P295 N239 1k
R39 N239 VSS 4.8k
J_A33 N235 N239 0 DR
R40 VDD N235 50k
J_A34 VDD N235 P296 DR
R41 P296 N234 1k
R42 N234 VSS 4.5k
R43 VDD N226 100k
J_F8 VDD N226 P297 DR
R44 P297 N233 1k
R45 N233 VSS 4.8k
J_B11 N226 N230 P298 DR
J_A35 N229 N233 0 DR
R46 VDD N229 50k
J_A36 VDD N229 P299 DR
R47 P299 Shift_Left 1k
R48 Shift_Left VSS 4.5k
J_B12 P298 N234 0 DR
R49 VDD N236 100k
J_F9 VDD N236 P300 DR
R50 P300 N245 1k
R51 N245 VSS 4.8k
J_B13 N236 N230 P301 DR
J_A37 N240 N245 0 DR
R52 VDD N240 50k
J_A38 VDD N240 P302 DR
R53 P302 Shift_Right 1k
R54 Shift_Right VSS 4.5k
J_B14 P301 N239 0 DR
R61 VDD CFStage1_Load 100k
J_F11 VDD CFStage1_Load P303 DR
R62 P303 !CFStage1_Loading 1k
R63 !CFStage1_Loading VSS 4.8k
J_A43 N014 !CFStage1_Loading 0 DR
R64 VDD N014 50k
J_A44 VDD N014 P304 DR
R65 P304 CFStage1_Loading 1k
R66 CFStage1_Loading VSS 4.5k
J_A46 N186 A_Q3 P305 DR
J_B17 P305 A_Q2 0 DR
J_A47 N186 T_Q3 P306 DR
J_B18 P306 A_Q2 0 DR
J_A48 N210 N204 0 DR
R67 VDD N210 50k
J_A49 VDD N210 P307 DR
R68 P307 SUMCF 1k
R69 SUMCF VSS 4.5k
J_A50 N222 N204 0 DR
R70 VDD N222 50k
J_A51 VDD N222 P308 DR
R71 P308 SUMCF 1k
R72 SUMCF VSS 4.5k
J_A41 CF_Rotate_Out N249 0 DR
R73 VDD CF_Rotate_Out 100k
J_F12 VDD CF_Rotate_Out P309 DR
R74 P309 N219 1k
R75 N219 VSS 4.8k
J_A39 N218 N219 0 DR
R76 VDD N218 50k
J_A40 VDD N218 P310 DR
R77 P310 SumCFRotated 1k
R78 SumCFRotated VSS 4.5k
.model NJF NJF
.model PJF PJF
.lib standard.jft
* ALU
* AZ
* Temp Inverter
* Accumulator
* CF In
* Temporary Register
* A>9
* CF Bus Out
* Acc Inverter
.backanno
.end